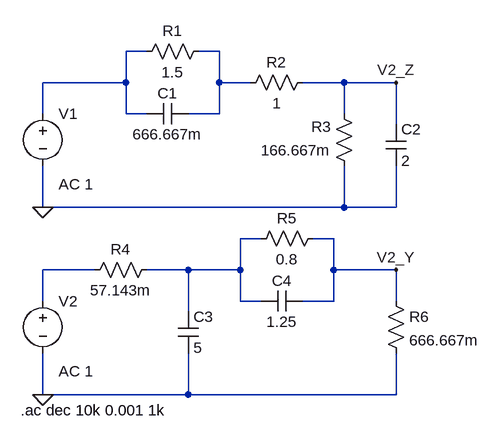
[diagram p0: schematic Punto2.asc]
Punto2.asc, the LTspice schematic file:
Version 4
SHEET 1 880 680
WIRE 160 48 128 48
WIRE 272 48 240 48
WIRE 128 96 128 48
WIRE 128 96 0 96
WIRE 272 96 272 48
WIRE 320 96 272 96
WIRE 464 96 400 96
WIRE 544 96 464 96
WIRE 0 144 0 96
WIRE 128 144 128 96
WIRE 160 144 128 144
WIRE 272 144 272 96
WIRE 272 144 224 144
WIRE 464 144 464 96
WIRE 544 160 544 96
WIRE 0 288 0 224
WIRE 464 288 464 224
WIRE 464 288 0 288
WIRE 544 288 544 224
WIRE 544 288 464 288
WIRE 336 336 304 336
WIRE 448 336 416 336
WIRE 80 384 0 384
WIRE 224 384 160 384
WIRE 304 384 304 336
WIRE 304 384 224 384
WIRE 448 384 448 336
WIRE 544 384 448 384
WIRE 0 432 0 384
WIRE 304 432 304 384
WIRE 336 432 304 432
WIRE 448 432 448 384
WIRE 448 432 400 432
WIRE 544 432 544 384
WIRE 224 448 224 384
WIRE 0 576 0 512
WIRE 224 576 224 512
WIRE 224 576 0 576
WIRE 544 576 544 512
WIRE 544 576 224 576
FLAG 0 288 0
FLAG 544 96 V2_Z
FLAG 0 576 0
FLAG 544 384 V2_Y
SYMBOL voltage 0 128 R0
WINDOW 123 24 124 Left 2
WINDOW 39 0 0 Left 0
SYMATTR InstName V1
SYMATTR Value ""
SYMATTR Value2 AC 1
SYMBOL res 256 32 R90
WINDOW 0 0 56 VBottom 2
WINDOW 3 32 56 VTop 2
SYMATTR InstName R1
SYMATTR Value 1.5
SYMBOL cap 224 128 R90
WINDOW 0 0 32 VBottom 2
WINDOW 3 32 32 VTop 2
SYMATTR InstName C1
SYMATTR Value 666.667m
SYMBOL res 416 80 R90
WINDOW 0 0 56 VBottom 2
WINDOW 3 32 56 VTop 2
SYMATTR InstName R2
SYMATTR Value 1
SYMBOL res 480 240 R180
WINDOW 0 36 76 Left 2
WINDOW 3 36 40 Left 2
SYMATTR InstName R3
SYMATTR Value 166.667m
SYMBOL cap 528 160 R0
SYMATTR InstName C2
SYMATTR Value 2
SYMBOL voltage 0 416 R0
WINDOW 123 24 124 Left 2
WINDOW 39 0 0 Left 0
SYMATTR InstName V2
SYMATTR Value ""
SYMATTR Value2 AC 1
SYMBOL res 176 368 R90
WINDOW 0 0 56 VBottom 2
WINDOW 3 32 56 VTop 2
SYMATTR InstName R4
SYMATTR Value 57.143m
SYMBOL cap 208 448 R0
SYMATTR InstName C3
SYMATTR Value 5
SYMBOL res 432 320 R90
WINDOW 0 0 56 VBottom 2
WINDOW 3 32 56 VTop 2
SYMATTR InstName R5
SYMATTR Value 0.8
SYMBOL cap 400 416 R90
WINDOW 0 0 32 VBottom 2
WINDOW 3 32 32 VTop 2
SYMATTR InstName C4
SYMATTR Value 1.25
SYMBOL res 528 416 R0
SYMATTR InstName R6
SYMATTR Value 666.667m
TEXT -34 600 Left 2 !.ac dec 10k 0.001 1k

The netlist it stands for:
* Punto2.asc
V1 N001 0 AC 1
R1 N002 N001 1.5
C1 N002 N001 666.667m
R2 V2_Z N002 1
R3 0 V2_Z 166.667m
C2 V2_Z 0 2
V2 N004 0 AC 1
R4 N003 N004 57.143m
C3 N003 0 5
R5 V2_Y N003 0.8
C4 V2_Y N003 1.25
R6 V2_Y 0 666.667m
.ac dec 10k 0.001 1k
.backanno
.end